# EAGLE schematic blimpy-2.0 (EAGLE 9.6.1)
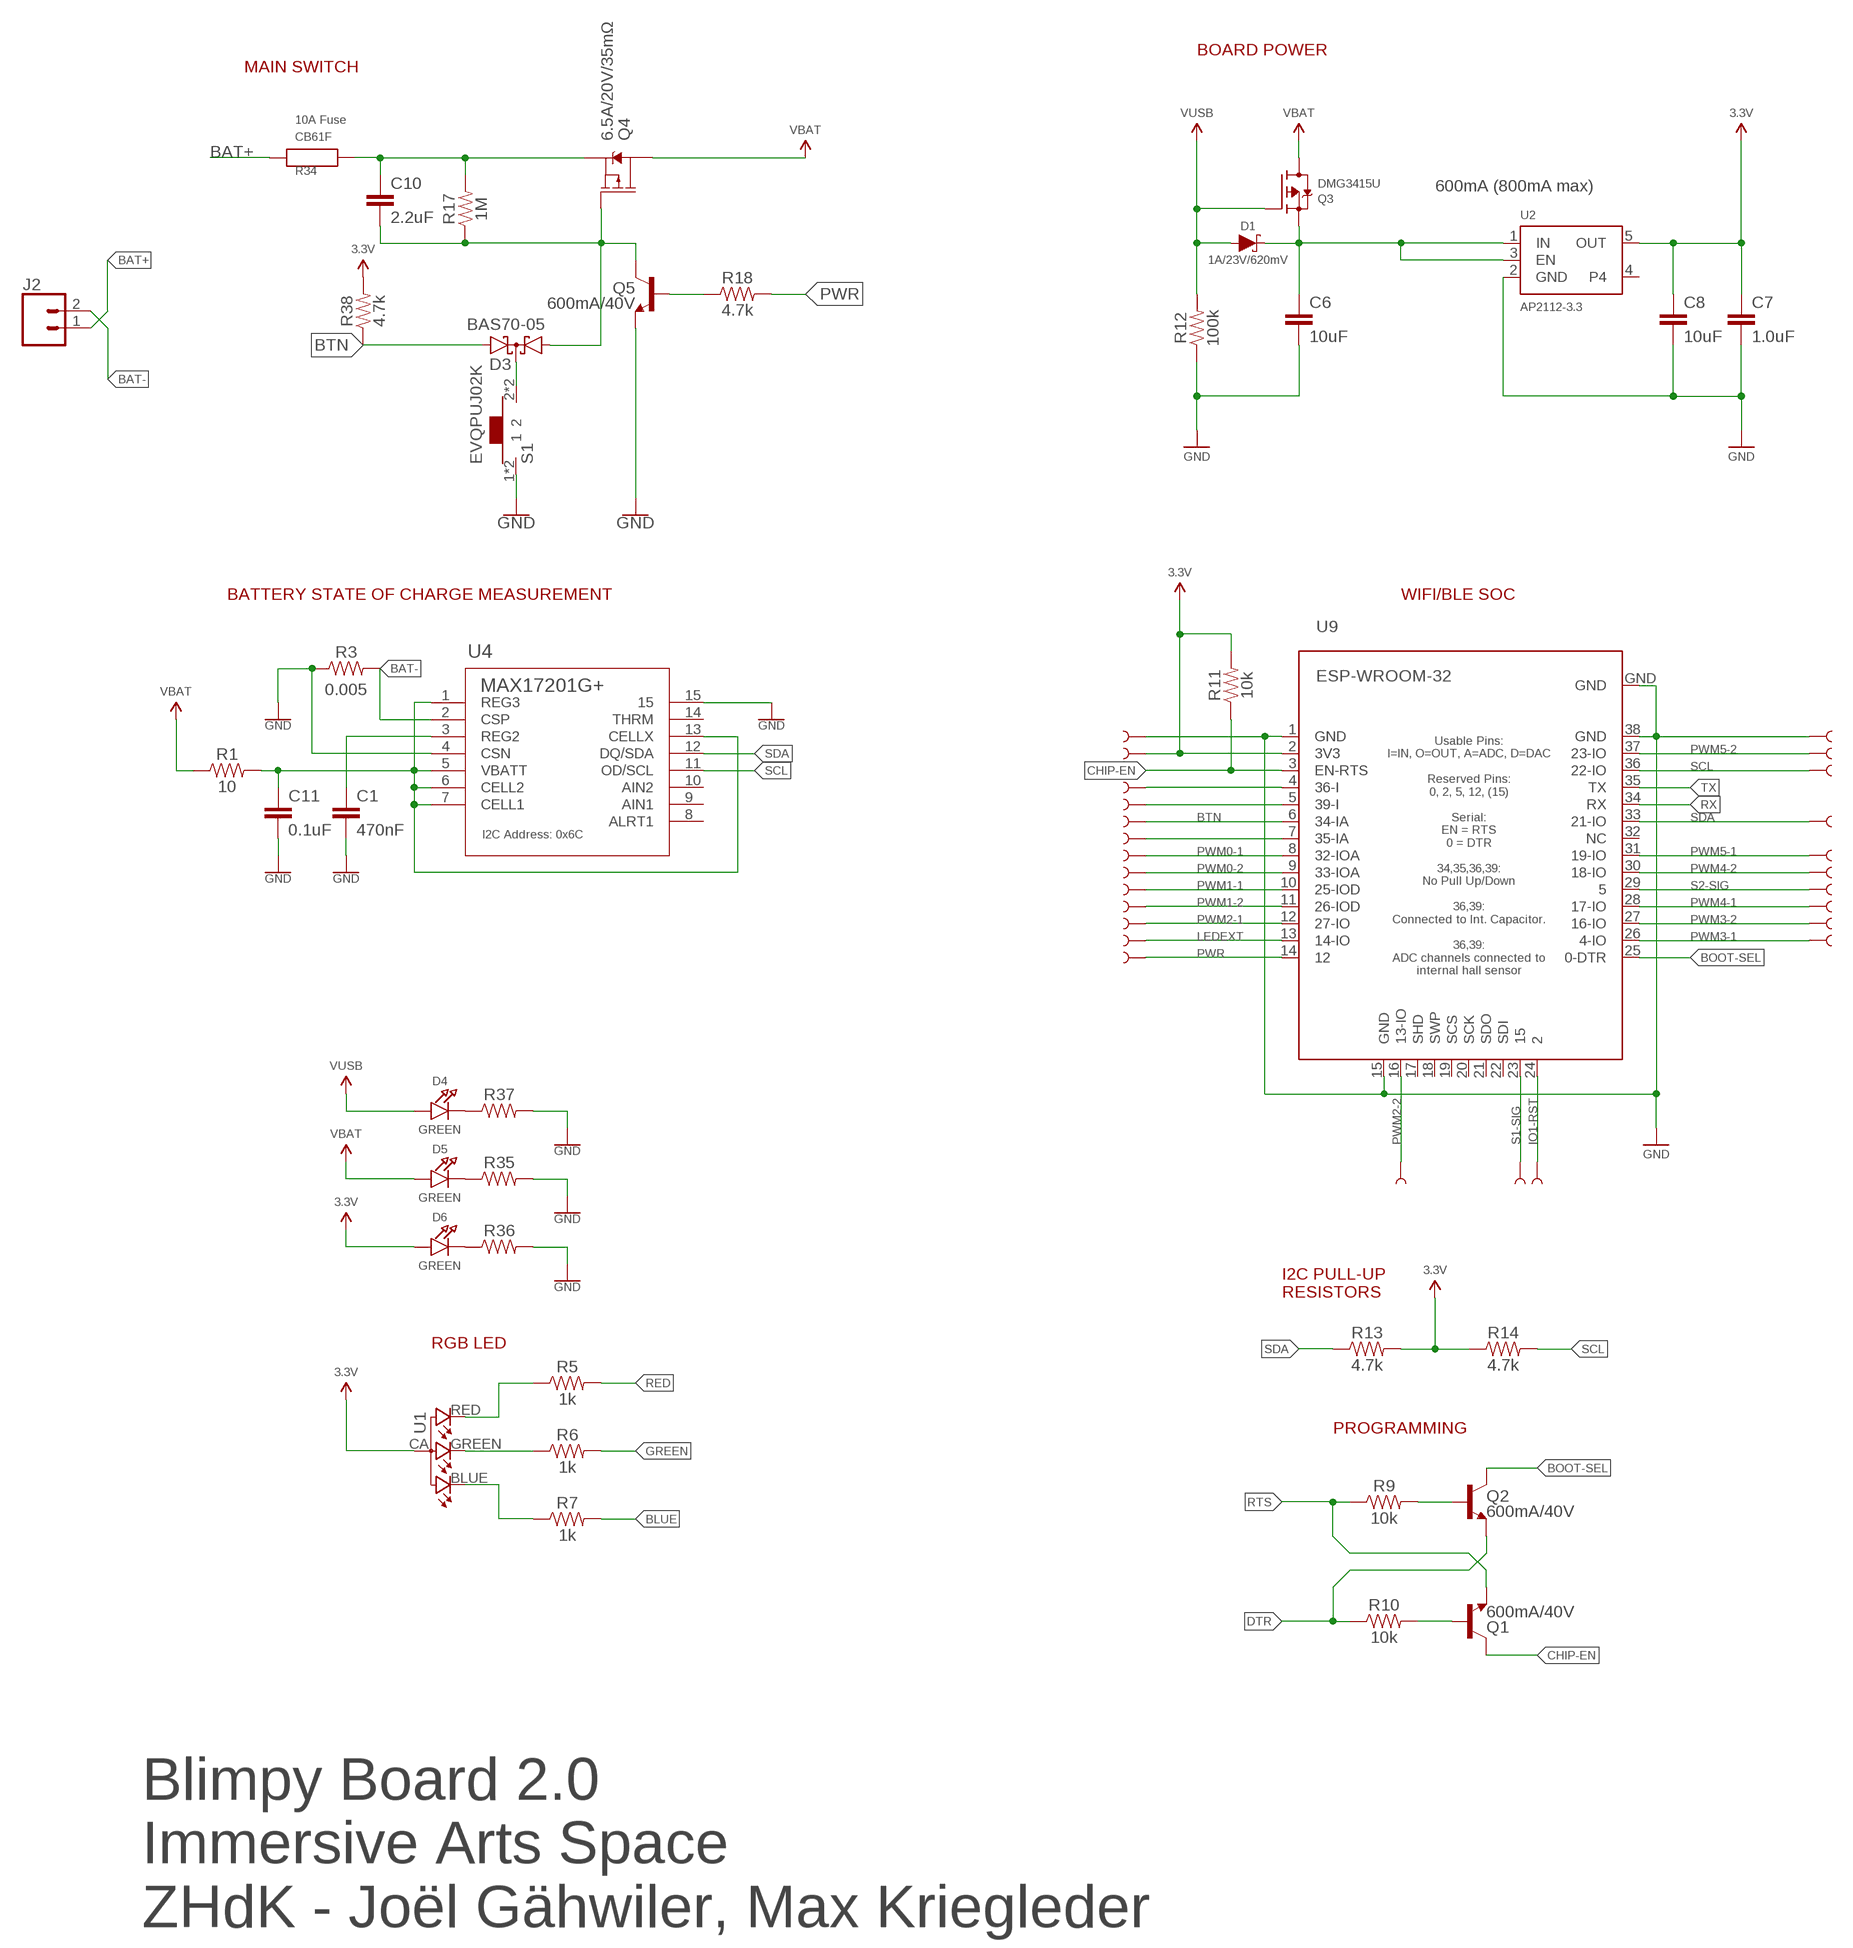
[diagram p0: schematic, sheet 1, part 1 of 2]
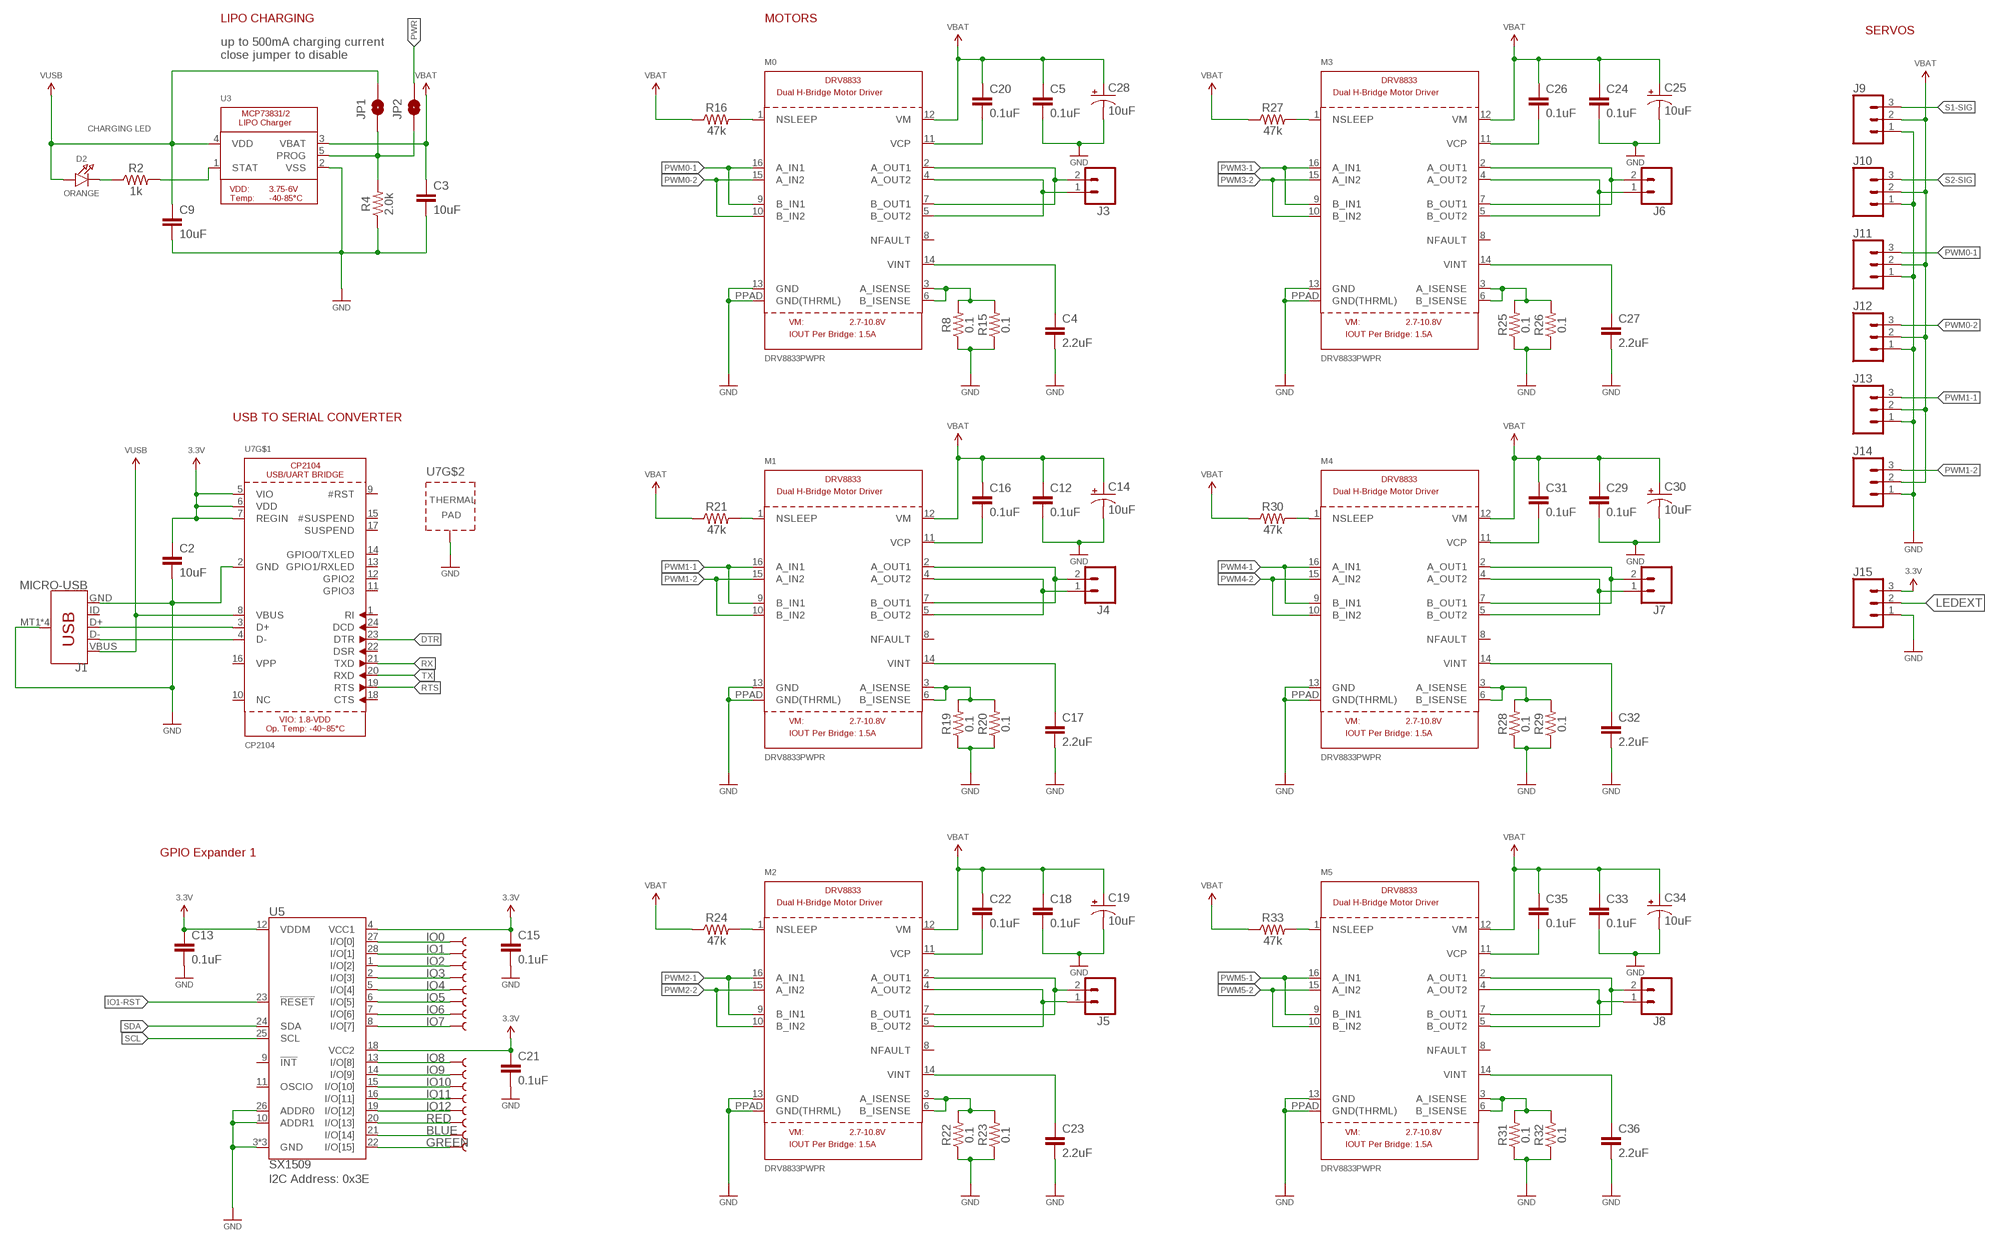
[diagram p1: schematic, sheet 1, part 2 of 2]

## Parts
C1  470nF  470NF-0608  [0603]
C2  10uF  10UF-0603-6.3V-20%  [0603]
C3  10uF  10UF-0603-6.3V-20%  [0603]
C4  2.2uF  2.2UF-0603-10V-20%  [0603]
C5  0.1uF  0.1UF-0603-25V-5%  [0603]
C6  10uF  10UF-0603-6.3V-20%  [0603]
C7  1.0uF  1.0UF-0603-16V-10%  [0603]
C8  10uF  10UF-0603-6.3V-20%  [0603]
C9  10uF  10UF-0603-6.3V-20%  [0603]
C10  2.2uF  2.2UF-0603-10V-20%  [0603]
C11  0.1uF  0.1UF-0603-25V-5%  [0603]
C12  0.1uF  0.1UF-0603-25V-5%  [0603]
C13  0.1uF  0.1UF-0603-25V-5%  [0603]
C14  10uF  10UF-POLAR-EIA3216-16V-10%(TANT)  [EIA3216]
C15  0.1uF  0.1UF-0603-25V-5%  [0603]
C16  0.1uF  0.1UF-0603-25V-5%  [0603]
C17  2.2uF  2.2UF-0603-10V-20%  [0603]
C18  0.1uF  0.1UF-0603-25V-5%  [0603]
C19  10uF  10UF-POLAR-EIA3216-16V-10%(TANT)  [EIA3216]
C20  0.1uF  0.1UF-0603-25V-5%  [0603]
C21  0.1uF  0.1UF-0603-25V-5%  [0603]
C22  0.1uF  0.1UF-0603-25V-5%  [0603]
C23  2.2uF  2.2UF-0603-10V-20%  [0603]
C24  0.1uF  0.1UF-0603-25V-5%  [0603]
C25  10uF  10UF-POLAR-EIA3216-16V-10%(TANT)  [EIA3216]
C26  0.1uF  0.1UF-0603-25V-5%  [0603]
C27  2.2uF  2.2UF-0603-10V-20%  [0603]
C28  10uF  10UF-POLAR-EIA3216-16V-10%(TANT)  [EIA3216]
C29  0.1uF  0.1UF-0603-25V-5%  [0603]
C30  10uF  10UF-POLAR-EIA3216-16V-10%(TANT)  [EIA3216]
C31  0.1uF  0.1UF-0603-25V-5%  [0603]
C32  2.2uF  2.2UF-0603-10V-20%  [0603]
C33  0.1uF  0.1UF-0603-25V-5%  [0603]
C34  10uF  10UF-POLAR-EIA3216-16V-10%(TANT)  [EIA3216]
C35  0.1uF  0.1UF-0603-25V-5%  [0603]
C36  2.2uF  2.2UF-0603-10V-20%  [0603]
D1  1A/23V/620mV  DIODE-SCHOTTKY-BAT20J  [SOD-323]
D2  ORANGE  LED0805_NOOUTLINE  [CHIPLED_0805_NOOUTLINE]
D3  BAS70-05  [SOT23]
D4  GREEN  LED0805_NOOUTLINE  [CHIPLED_0805_NOOUTLINE]
D5  GREEN  LED0805_NOOUTLINE  [CHIPLED_0805_NOOUTLINE]
D6  GREEN  LED0805_NOOUTLINE  [CHIPLED_0805_NOOUTLINE]
J1  MICRO-USB  USB_MICRO-B_SMT  [USB-MICROB]
J2  CONN_02PTH4  [1X02_XTRA_BIG]
J3  CONN_02-JST-2MM-SMT  [JST-2-SMD]
J4  CONN_02-JST-2MM-SMT  [JST-2-SMD]
J5  CONN_02-JST-2MM-SMT  [JST-2-SMD]
J6  CONN_02-JST-2MM-SMT  [JST-2-SMD]
J7  CONN_02-JST-2MM-SMT  [JST-2-SMD]
J8  CONN_02-JST-2MM-SMT  [JST-2-SMD]
J9  3-PIN SMD  CONN_03JST-SMD  [JST-3-SMD]
J10  3-PIN SMD  CONN_03JST-SMD  [JST-3-SMD]
J11  3-PIN SMD  CONN_03JST-SMD  [JST-3-SMD]
J12  3-PIN SMD  CONN_03JST-SMD  [JST-3-SMD]
J13  3-PIN SMD  CONN_03JST-SMD  [JST-3-SMD]
J14  3-PIN SMD  CONN_03JST-SMD  [JST-3-SMD]
J15  3-PIN SMD  CONN_03JST-SMD  [JST-3-SMD]
JP1  JUMPER-SMT_2_NO_SILK  [SMT-JUMPER_2_NO_SILK]
JP2  JUMPER-SMT_2_NO_SILK  [SMT-JUMPER_2_NO_SILK]
M0  DRV8833PWPR  DRV8833  [HTSSOP16]
M1  DRV8833PWPR  DRV8833  [HTSSOP16]
M2  DRV8833PWPR  DRV8833  [HTSSOP16]
M3  DRV8833PWPR  DRV8833  [HTSSOP16]
M4  DRV8833PWPR  DRV8833  [HTSSOP16]
M5  DRV8833PWPR  DRV8833  [HTSSOP16]
Q1  600mA/40V  TRANS_NPN-MMBT2222AL  [SOT23-3]
Q2  600mA/40V  TRANS_NPN-MMBT2222AL  [SOT23-3]
Q3  DMG3415U  MOSFET-P  [SOT23-R]
Q4  6.5A/20V/35mΩ  MOSFET_PCH-NDS8434  [SO08]
Q5  600mA/40V  TRANS_NPN-MMBT2222AL  [SOT23-3]
R1  10  10OHM-0603-1/10W-1%  [0603]
R2  1k  1KOHM-0603-1/10W-1%  [0603]
R3  0.005  RESISTOR1206  [1206]
R4  2.0k  2.0KOHM-0603-1/10W-5%  [0603]
R5  1k  1KOHM-0603-1/10W-1%  [0603]
R6  1k  1KOHM-0603-1/10W-1%  [0603]
R7  1k  1KOHM-0603-1/10W-1%  [0603]
R8  0.1  RESISTOR1206  [1206]
R9  10k  10KOHM-0603-1/10W-1%  [0603]
R10  10k  10KOHM-0603-1/10W-1%  [0603]
R11  10k  10KOHM-0603-1/10W-1%  [0603]
R12  100k  100KOHM-0603-1/10W-1%  [0603]
R13  4.7k  4.7KOHM-0603-1/10W-1%  [0603]
R14  4.7k  4.7KOHM-0603-1/10W-1%  [0603]
R15  0.1  RESISTOR1206  [1206]
R16  47k  47KOHM-0603-1/10W-1%  [0603]
R17  1M  1MOHM-0603-1/4W-5%  [0603]
R18  4.7k  4.7KOHM-0603-1/10W-1%  [0603]
R19  0.1  RESISTOR1206  [1206]
R20  0.1  RESISTOR1206  [1206]
R21  47k  47KOHM-0603-1/10W-1%  [0603]
R22  0.1  RESISTOR1206  [1206]
R23  0.1  RESISTOR1206  [1206]
R24  47k  47KOHM-0603-1/10W-1%  [0603]
R25  0.1  RESISTOR1206  [1206]
R26  0.1  RESISTOR1206  [1206]
R27  47k  47KOHM-0603-1/10W-1%  [0603]
R28  0.1  RESISTOR1206  [1206]
R29  0.1  RESISTOR1206  [1206]
R30  47k  47KOHM-0603-1/10W-1%  [0603]
R31  0.1  RESISTOR1206  [1206]
R32  0.1  RESISTOR1206  [1206]
R33  47k  47KOHM-0603-1/10W-1%  [0603]
R34  CB61F  [CB61F]
R35  RESISTOR0603  [0603]
R36  RESISTOR0603  [0603]
R37  RESISTOR0603  [0603]
R38  4.7k  1MOHM-0603-1/4W-5%  [0603]
S1  EVQPUJ02K  [EVQPUJ02K]
TP1  TEST-POINT3  [PAD.03X.03]
TP2  TEST-POINT3  [PAD.03X.03]
TP3  TEST-POINT3  [PAD.03X.03]
TP4  TEST-POINT3  [PAD.03X.03]
TP5  TEST-POINT3  [PAD.03X.03]
TP6  TEST-POINT3  [PAD.03X.03]
TP7  TEST-POINT3  [PAD.03X.03]
TP8  TEST-POINT3  [PAD.03X.03]
TP9  TEST-POINT3  [PAD.03X.03]
TP10  TEST-POINT3  [PAD.03X.03]
TP11  TEST-POINT3  [PAD.03X.03]
TP12  TEST-POINT3  [PAD.03X.03]
TP13  TEST-POINT3  [PAD.03X.03]
TP14  TEST-POINT3  [PAD.03X.03]
TP15  TEST-POINT3  [PAD.03X.03]
TP16  TEST-POINT3  [PAD.03X.03]
TP17  TEST-POINT3  [PAD.03X.03]
TP18  TEST-POINT3  [PAD.03X.03]
TP19  TEST-POINT3  [PAD.03X.03]
TP20  TEST-POINT3  [PAD.03X.03]
TP21  TEST-POINT3  [PAD.03X.03]
TP22  TEST-POINT3  [PAD.03X.03]
TP23  TEST-POINT3  [PAD.03X.03]
TP24  TEST-POINT3  [PAD.03X.03]
TP25  TEST-POINT3  [PAD.03X.03]
TP26  TEST-POINT3  [PAD.03X.03]
TP27  TEST-POINT3  [PAD.03X.03]
TP28  TEST-POINT3  [PAD.03X.03]
TP29  TEST-POINT3  [PAD.03X.03]
TP30  TEST-POINT3  [PAD.03X.03]
TP31  TEST-POINT3  [PAD.03X.03]
TP32  TEST-POINT3  [PAD.03X.03]
TP33  TEST-POINT3  [PAD.03X.03]
TP34  TEST-POINT3  [PAD.03X.03]
TP35  TEST-POINT3  [PAD.03X.03]
TP36  TEST-POINT3  [PAD.03X.03]
TP37  TEST-POINT3  [PAD.03X.03]
TP38  TEST-POINT3  [PAD.03X.03]
TP39  TEST-POINT3  [PAD.03X.03]
TP40  TEST-POINT3  [PAD.03X.03]
TP41  TEST-POINT3  [PAD.03X.03]
TP42  TEST-POINT3  [PAD.03X.03]
U1  PARTICLE_RGB-LED-CLMVB-FKARGB  [PARTICLE_PLCC4-2MM-RGB]
U2  AP2112-3.3  VREG_SOT23-5  [SOT23-5]
U3  MICROBUILDER_MCP73831/2  [MICROBUILDER_SOT23-5]
U4  MAX17201G+  [21-0137I_T1433-1_MXM]
U5  SX1509  [QFN-28]
U7  CP2104  [QFN24_4MM_SMSC]
U9  ESP-WROOM-32  [ESP-WROOM-32]

## Nets
3.3V: C2.1 C7.1 C8.1 C13.1 C15.1 C21.1 D6.A J15.3 R11.2 R13.2 R14.1 R38.2 TP11.P$1 U1.CA U2.5(OUT) U5.4(VCC1) U5.12(VDDM) U5.18(VCC2) U7.5(VIO) U7.6(VDD) U7.7(REGIN) U9.2(3V3)
BAT+: J2.1 R34.1
BAT-: J2.2 R3.2 U4.2(CSP)
BLUE: R7.2 TP41.P$1 U5.21(I/O[14])
BOOT-SEL: Q2.3(C) U9.25(0-DTR)
BTN: D3.2(A2) R38.1 TP8.P$1 U9.6(34-IA)
CHIP-EN: Q1.3(C) R11.1 U9.3(EN-RTS)
DTR: Q2.2(E) R10.1 U7.23(DTR)
GND: C1.2 C2.2 C3.2 C4.2 C5.2 C6.2 C7.2 C8.2 C9.2 C11.2 C12.2 C13.2 C14.- C15.2 C17.2 C18.2 C19.- C21.2 C23.2 C24.2 C25.- C27.2 C28.- C29.2 C30.- C32.2 C33.2 C34.- C36.2 J1.GND J1.MT1(SHIELD) J1.MT2(SHIELD) J1.P$1(SHIELD) J1.P$2(SHIELD) J9.1 J10.1 J11.1 J12.1 J13.1 J14.1 J15.1 M0.13(GND) M0.PPAD(GND(THRML)) M1.13(GND) M1.PPAD(GND(THRML)) M2.13(GND) M2.PPAD(GND(THRML)) M3.13(GND) M3.PPAD(GND(THRML)) M4.13(GND) M4.PPAD(GND(THRML)) M5.13(GND) M5.PPAD(GND(THRML)) Q5.2(E) R3.1 R4.1 R8.1 R12.1 R15.1 R19.1 R20.1 R22.1 R23.1 R25.1 R26.1 R28.1 R29.1 R31.1 R32.1 R35.2 R36.2 R37.2 S1.1 S1.3 TP12.P$1 TP13.P$1 U2.2(GND) U3.2(VSS) U4.4(CSN) U4.15 U5.3(GND) U5.10(ADDR1) U5.17(GND) U5.26(ADDR0) U5.29(GND) U7.2(GND) U7.THERM(TP) U9.1(GND) U9.15(GND) U9.38(GND) U9.GND
GREEN: R6.2 TP42.P$1 U5.22(I/O[15])
IO0: TP27.P$1 U5.27(I/O[0])
IO1: TP28.P$1 U5.28(I/O[1])
IO1-RST: TP26.P$1 U5.23(!RESET) U9.24
IO2: TP29.P$1 U5.1(I/O[2])
IO3: TP30.P$1 U5.2(I/O[3])
IO4: TP31.P$1 U5.5(I/O[4])
IO5: TP32.P$1 U5.6(I/O[5])
IO6: TP33.P$1 U5.7(I/O[6])
IO7: TP34.P$1 U5.8(I/O[7])
IO8: TP35.P$1 U5.13(I/O[8])
IO9: TP36.P$1 U5.14(I/O[9])
IO10: TP37.P$1 U5.15(I/O[10])
IO11: TP38.P$1 U5.16(I/O[11])
IO12: TP39.P$1 U5.19(I/O[12])
LEDEXT: J15.2 TP5.P$1 U9.13(14-IO)
N$1: D2.C R2.1
N$2: J1.D+ U7.3(D+)
N$3: R2.2 U3.1(STAT)
N$4: JP1.1 JP2.1 R4.2 U3.5(PROG)
N$5: M0.1(NSLEEP) R16.2
N$6: J1.D- U7.4(D-)
N$7: C6.1 D1.C Q3.2(S) U2.1(IN) U2.3(EN)
N$8: C1.1 U4.3(REG2)
N$9: R5.1 U1.RED
N$10: R7.1 U1.BLUE
N$11: R6.1 U1.GREEN
N$12: Q1.1(B) R10.2
N$13: Q2.1(B) R9.2
N$14: M0.3(A_ISENSE) M0.6(B_ISENSE) R8.2 R15.2
N$15: C11.1 R1.2 U4.1(REG3) U4.5(VBATT) U4.6(CELL2) U4.7(CELL1) U4.13(CELLX)
N$16: C10.2 D3.1(A1) Q4.4(G) Q5.3(C) R17.1
N$17: D4.C R37.1
N$18: C10.1 Q4.1(S) Q4.2(S) Q4.3(S) R17.2 R34.2
N$19: TP9.P$1 U9.5(39-I)
N$21: TP7.P$1 U9.7(35-IA)
N$22: D3.3(C) S1.2 S1.4
N$23: Q5.1(B) R18.1
N$24: J4.1 M1.4(A_OUT2) M1.5(B_OUT2)
N$25: J4.2 M1.2(A_OUT1) M1.7(B_OUT1)
N$26: C17.1 M1.14(VINT)
N$27: C16.2 M1.11(VCP)
N$28: M1.3(A_ISENSE) M1.6(B_ISENSE) R19.2 R20.2
N$29: M1.1(NSLEEP) R21.2
N$30: J6.1 M3.4(A_OUT2) M3.5(B_OUT2)
N$31: J5.1 M2.4(A_OUT2) M2.5(B_OUT2)
N$32: C23.1 M2.14(VINT)
N$33: C22.2 M2.11(VCP)
N$34: M2.3(A_ISENSE) M2.6(B_ISENSE) R22.2 R23.2
N$35: M2.1(NSLEEP) R24.2
N$36: J6.2 M3.2(A_OUT1) M3.7(B_OUT1)
N$37: J3.2 M0.2(A_OUT1) M0.7(B_OUT1)
N$38: J7.1 M4.4(A_OUT2) M4.5(B_OUT2)
N$39: C27.1 M3.14(VINT)
N$40: C26.2 M3.11(VCP)
N$41: M3.3(A_ISENSE) M3.6(B_ISENSE) R25.2 R26.2
N$42: M3.1(NSLEEP) R27.2
N$43: J8.2 M5.2(A_OUT1) M5.7(B_OUT1)
N$44: J7.2 M4.2(A_OUT1) M4.7(B_OUT1)
N$45: C32.1 M4.14(VINT)
N$46: C31.2 M4.11(VCP)
N$47: M4.3(A_ISENSE) M4.6(B_ISENSE) R28.2 R29.2
N$48: J5.2 M2.2(A_OUT1) M2.7(B_OUT1)
N$49: M4.1(NSLEEP) R30.2
N$50: J8.1 M5.4(A_OUT2) M5.5(B_OUT2)
N$51: D6.C R36.1
N$52: C36.1 M5.14(VINT)
N$53: C35.2 M5.11(VCP)
N$54: M5.3(A_ISENSE) M5.6(B_ISENSE) R31.2 R32.2
N$55: M5.1(NSLEEP) R33.2
N$56: D5.C R35.1
N$57: TP10.P$1 U9.4(36-I)
N$58: J3.1 M0.4(A_OUT2) M0.5(B_OUT2)
N$61: C4.1 M0.14(VINT)
N$64: C20.2 M0.11(VCP)
PWM0-1: J11.3 M0.9(B_IN1) M0.16(A_IN1) TP1.P$1 U9.8(32-IOA)
PWM0-2: J12.3 M0.10(B_IN2) M0.15(A_IN2) TP2.P$1 U9.9(33-IOA)
PWM1-1: J13.3 M1.9(B_IN1) M1.16(A_IN1) TP3.P$1 U9.10(25-IOD)
PWM1-2: J14.3 M1.10(B_IN2) M1.15(A_IN2) TP6.P$1 U9.11(26-IOD)
PWM2-1: M2.9(B_IN1) M2.16(A_IN1) TP17.P$1 U9.12(27-IO)
PWM2-2: M2.10(B_IN2) M2.15(A_IN2) TP23.P$1 U9.16(13-IO)
PWM3-1: M3.9(B_IN1) M3.16(A_IN1) TP16.P$1 U9.26(4-IO)
PWM3-2: M3.10(B_IN2) M3.15(A_IN2) TP15.P$1 U9.27(16-IO)
PWM4-1: M4.9(B_IN1) M4.16(A_IN1) TP22.P$1 U9.28(17-IO)
PWM4-2: M4.10(B_IN2) M4.15(A_IN2) TP21.P$1 U9.30(18-IO)
PWM5-1: M5.9(B_IN1) M5.16(A_IN1) TP20.P$1 U9.31(19-IO)
PWM5-2: M5.10(B_IN2) M5.15(A_IN2) TP14.P$1 U9.37(23-IO)
PWR: JP2.2 R18.2 TP4.P$1 U9.14
RED: R5.2 TP40.P$1 U5.20(I/O[13])
RTS: Q1.2(E) R9.1 U7.19(RTS)
RX: U7.21(TXD) U9.34(RX)
S1-SIG: J9.3 TP24.P$1 U9.23
S2-SIG: J10.3 TP25.P$1 U9.29
SCL: R14.2 TP18.P$1 U4.11(OD/SCL) U5.25(SCL) U9.36(22-IO)
SDA: R13.1 TP19.P$1 U4.12(DQ/SDA) U5.24(SDA) U9.33(21-IO)
TX: U7.20(RXD) U9.35(TX)
V_BATT: C3.1 C5.1 C12.1 C14.+ C16.1 C18.1 C19.+ C20.1 C22.1 C24.1 C25.+ C26.1 C28.+ C29.1 C30.+ C31.1 C33.1 C34.+ C35.1 D5.A J9.2 J10.2 J11.2 J12.2 J13.2 J14.2 M0.12(VM) M1.12(VM) M2.12(VM) M3.12(VM) M4.12(VM) M5.12(VM) Q3.3(D) Q4.5(D) Q4.6(D) Q4.7(D) Q4.8(D) R1.1 R16.1 R21.1 R24.1 R27.1 R30.1 R33.1 U3.3(VBAT) ; supply symbol labelled VBAT
V_USB: C9.1 D1.A D2.A D4.A J1.VBUS JP1.2 Q3.1(G) R12.2 U3.4(VDD) U7.8(VBUS) ; supply symbol labelled VUSB
Unconnected: J1.ID M0.8(NFAULT) M1.8(NFAULT) M2.8(NFAULT) M3.8(NFAULT) M4.8(NFAULT) M5.8(NFAULT) U2.4 U4.8(ALRT1) U4.9(AIN1) U4.10(AIN2) U4.14(THRM) U5.9(!INT) U5.11(OSCIO) U7.1(RI) U7.9(#RST) U7.10(NC) U7.11(GPIO3) U7.12(GPIO2) U7.13(GPIO1/RXLED) U7.14(GPIO0/TXLED) U7.15(#SUSPEND) U7.16(VPP) U7.17(SUSPEND) U7.18(CTS) U7.22(DSR) U7.24(DCD) U9.17(SHD) U9.18(SWP) U9.19(SCS) U9.20(SCK) U9.21(SDO) U9.22(SDI) U9.32(NC)

## Notes on the sheet
- LIPO CHARGING | MOTORS
- BOARD POWER | SERVOS
- MAIN SWITCH
- up to 500mA charging current
  close jumper to disable
- 10A Fuse
- 600mA (800mA max) | CHARGING LED
- BATTERY STATE OF CHARGE MEASUREMENT | WIFI/BLE SOC | USB TO SERIAL CONVERTER
- I2C Address: 0x6C
- GPIO Expander 1
- I2C PULL-UP
  RESISTORS
- RGB LED
- PROGRAMMING
- I2C Address: 0x3E
- Blimpy Board 2.0
  Immersive Arts Space
  ZHdK - Joël Gähwiler, Max Kriegleder

## Library data of the parts
C1 = SparkFun-Capacitors:470NF: 0.47uF/470nF ceramic capacitors A capacitor is a passive two-terminal electrical component used to store electrical energy temporarily in an electric field.
C2 C3 C6 C8 C9 = SparkFun-Capacitors:10UF: 10.0µF ceramic capacitors A capacitor is a passive two-terminal electrical component used to store electrical energy temporarily in an electric field.; PROD_ID: CAP-11015
C4 C10 C17 C23 C27 C32 C36 = SparkFun-Capacitors:2.2UF: 2.2µF ceramic capacitors A capacitor is a passive two-terminal electrical component used to store electrical energy temporarily in an electric field.; PROD_ID: CAP-07888
C5 C11-C13 C15 C16 C18 C20-C22 C24 C26 C29 C31 C33 C35 = SparkFun-Capacitors:0.1UF: 0.1µF ceramic capacitors A capacitor is a passive two-terminal electrical component used to store electrical energy temporarily in an electric field.; PROD_ID: CAP-08604
C7 = SparkFun-Capacitors:1.0UF: 1µF ceramic capacitors A capacitor is a passive two-terminal electrical component used to store electrical energy temporarily in an electric field.; PROD_ID: CAP-00868
C14 C19 C25 C28 C30 C34 = SparkFun-Capacitors:10UF-POLAR: 10.0µF polarized capacitors A capacitor is a passive two-terminal electrical component used to store electrical energy temporarily in an electric field.; PROD_ID: CAP-00811
D1 = SparkFun-DiscreteSemi:DIODE-SCHOTTKY: Schottky diode A Schottky diode is a semiconductor diode which has a low forward voltage drop and a very fast switching action.; PROD_ID: DIO-11623
D2 D4-D6 = microbuilder:LED: LED 0603 - 0603 Surface Mount Package 2mA: Green LED - Low Power (3.9mcd, 2ma, 1.7Vf) - Digikey: 475-2709-2-ND Orange LED - Low Power (9.8mcd, 2ma, 1.8Vf) - Digikey: 475-1194-2-ND Red LED - Low Power (5mcd, 2ma, 1.8Vf) - Digikey: 475-1195-2-ND Yellow LED - Low Power (7mcd, 2ma, 1.8Vf) - Digikey: 475-1196-2-ND 5mA: Blue LED - Low Power (17mcd, 5ma, 2.9Vf) - Digikey: LNJ937W8CRACT-ND 0805 - 0805 Surface Mount Package 2mA: Red LED (8.8mcd, 2mA, 1.8Vf, Clear) - Low Power [Digikey: 475-2510-1-ND] Green LED (5mcd, 2mA, 1.8Vf, Clear) - Low Power [Digikey: 475-2730-1-ND] Yellow LED (11.3mcd, 2mA, 1.8Vf, Clear) - Low Power [Digikey: 475-2555-1-ND] 20mA: Red LED (104mcd, 20mA, Diffused) - LS R976 [Digikey: 475-1278-6-ND] Red LED (12mcd, 20mA, 2.0Vf, Clear) - APT2012EC [Digikey: 754-1128-1-ND] Green LED (15mcd, 20mA, 2.2Vf, Clear) - APT2012GC [Digikey: 754-1131-1-ND] Orange LED (160mcd, 20mA, 2.1Vf, Clear) - APT2012SECK [Digikey: 754-1130-1-ND] 1206 - 1206 Surface Mount Package Green LED (26mcd, 20mA, Diffused) - LG N971 [Digikey: 475-1407-6-ND] Red LED (15mcd, 20mA, Diffused) - LH N974 [Digikey: 475-1416-6-ND] Cree - Cree High-Power Surface Mount LEDs XPEBWT-L1-0000-00D50 - White 111lm 350mA 2.9Vf 6200K 110° XTEAWT-00-0000-00000LEE3 - White 114lm 350mA 2.85Vf 5000K 115° Everlight - Everlight 45-21 Series Surface Mount LEDs 45-21/QK2C-B2832AC2CB2/2T - Warm White 2000mcd 20mA 3.25Vf 3050K 120° 45-21/LK2C-B38452C4CB2/2T - Nuetral White 2000mcd 20mA 3.25Vf 4150K 120° 45-21/LK2C-B50634C6CB2/2T - Cold White 2200mcd 20mA 3.25Vf 5650K 120° PLCC2 Reverse Mount LS T77K-J1L2-1-0-2-R18-Z - Red 11.25mcd 2mA 1.8Vf 630nm 120° LO T77K-L1M2-24-Z - Orange 19.6mcd 2mA 1.8Vf 606nm 120° LY T77K-K2M1-26-Z - Yellow 15.7mcd 2mA 1.8Vf 587nm 120°
D3 = diode:BAS70-05: Silicon Schottky Diodes General-purpose diode for high-speed switching
J1 = SparkFun-Connectors:USB_MICRO-B: USB Type Micro-B Connector Male/female and PTH/SMT variants SparkFun Products: SparkFun microB USB Breakout <https://www.sparkfun.com/products/12035> SparkFun USB microB Plug Breakout <https://www.sparkfun.com/products/10031> SparkFun ESP8266 Thing <https://www.sparkfun.com/products/13231>; PROD_ID: CONN-09505; SF_ID: PRT-08533
J2 = SparkFun-Connectors:CONN_02: Multi connection point. Often used as Generic Header-pin footprint for 0.1 inch spaced/style header connections On any of the 0.1 inch spaced packages, you can populate with these: Break Away Headers - Straight <https://www.sparkfun.com/products/116> (PRT-00116) Break Away Male Headers - Right Angle <https://www.sparkfun.com/products/553> (PRT-00553) Female Headers <https://www.sparkfun.com/products/115> (PRT-00115) Break Away Headers - Machine Pin <https://www.sparkfun.com/products/117> (PRT-00117) Break Away Female Headers - Swiss Machine Pin <https://www.sparkfun.com/products/743> (PRT-00743) For SCREWTERMINALS and SPRING TERMINALS visit here: Screw Terimnals on SparkFun.com <https://www.sparkfun.com/search/results?term=Screw+Terminals> (5mm/3.5mm/2.54mm spacing) This device is also useful as a general connection point to wire up your design to another part of your project. Our various solder wires solder well into these plated through hole pads. Hook-Up Wire - Assortment (Stranded, 22 AWG) <https://www.sparkfun.com/products/11375> (PRT-11375) Hook-Up Wire - Assortment (Solid Core, 22 AWG) <https://www.sparkfun.com/products/11367> (PRT-11367) View the entire wire category on our website here <https://www.sparkfun.com/categories/141> Special notes: Molex polarized connector foot print use with: PRT-08233 with associated crimp pins and housings. 2.54_SCREWTERM for use with PRT-10571. 3.5mm Screw Terminal footprints for PRT-08084 5mm Screw Terminal footprints for use with PRT-08432
J3-J8 = SparkFun-Connectors:CONN_02: Multi connection point. Often used as Generic Header-pin footprint for 0.1 inch spaced/style header connections On any of the 0.1 inch spaced packages, you can populate with these: Break Away Headers - Straight <https://www.sparkfun.com/products/116> (PRT-00116) Break Away Male Headers - Right Angle <https://www.sparkfun.com/products/553> (PRT-00553) Female Headers <https://www.sparkfun.com/products/115> (PRT-00115) Break Away Headers - Machine Pin <https://www.sparkfun.com/products/117> (PRT-00117) Break Away Female Headers - Swiss Machine Pin <https://www.sparkfun.com/products/743> (PRT-00743) For SCREWTERMINALS and SPRING TERMINALS visit here: Screw Terimnals on SparkFun.com <https://www.sparkfun.com/search/results?term=Screw+Terminals> (5mm/3.5mm/2.54mm spacing) This device is also useful as a general connection point to wire up your design to another part of your project. Our various solder wires solder well into these plated through hole pads. Hook-Up Wire - Assortment (Stranded, 22 AWG) <https://www.sparkfun.com/products/11375> (PRT-11375) Hook-Up Wire - Assortment (Solid Core, 22 AWG) <https://www.sparkfun.com/products/11367> (PRT-11367) View the entire wire category on our website here <https://www.sparkfun.com/categories/141> Special notes: Molex polarized connector foot print use with: PRT-08233 with associated crimp pins and housings. 2.54_SCREWTERM for use with PRT-10571. 3.5mm Screw Terminal footprints for PRT-08084 5mm Screw Terminal footprints for use with PRT-08432; PROD_ID: CONN-11443
J9-J15 = SparkFun-Connectors:CONN_03: Multi connection point. Often used as Generic Header-pin footprint for 0.1 inch spaced/style header connections On any of the 0.1 inch spaced packages, you can populate with these: Break Away Headers - Straight <https://www.sparkfun.com/products/116> (PRT-00116) Break Away Male Headers - Right Angle <https://www.sparkfun.com/products/553> (PRT-00553) Female Headers <https://www.sparkfun.com/products/115> (PRT-00115) Break Away Headers - Machine Pin <https://www.sparkfun.com/products/117> (PRT-00117) Break Away Female Headers - Swiss Machine Pin <https://www.sparkfun.com/products/743> (PRT-00743) Stackable Header - 3 Pin (Female, 0.1") <https://www.sparkfun.com/products/13875> (PRT-13875) For SCREWTERMINALS and SPRING TERMINALS visit here: Screw Terimnals on SparkFun.com <https://www.sparkfun.com/search/results?term=Screw+Terminals> (5mm/3.5mm/2.54mm spacing) This device is also useful as a general connection point to wire up your design to another part of your project. Our various solder wires solder well into these plated through hole pads. Hook-Up Wire - Assortment (Stranded, 22 AWG) <https://www.sparkfun.com/products/11375> (PRT-11375) Hook-Up Wire - Assortment (Solid Core, 22 AWG) <https://www.sparkfun.com/products/11367> (PRT-11367) View the entire wire category on our website here <https://www.sparkfun.com/categories/141> Special notes: Molex polarized connector foot print use with SKU : PRT-08232 with associated crimp pins and housings.; PROD_ID: CONN-12591
JP1 JP2 = SparkFun-Jumpers:JUMPER-SMT_2_NO: Normally open jumper This jumper has two pads in close proximity to each other. Apply solder to close the connection. Round pads are easier to solder for beginners, but are a lot larger. SparkFun Product that uses the round pads: SparkFun EL Sequencer <https://www.sparkfun.com/products/12781>
M0 M1-M5 = microbuilder:DRV8833: DRV8833 Dual H-Bridge Motor Driver -- HTSSOP Package
Q1 Q2 Q5 = SparkFun-DiscreteSemi:TRANS_NPN: NPN transistor Current controlled devices typically used to amplify current or used as a switch. BC547 - COM-08928 <http://www.sparkfun.com/products/8928> (TO-92 45V 100mA) (1.Collector 2.Base 3.Emitter) 2N3904 - COM-00521 <http://www.sparkfun.com/products/521> (TO-92 40V 200mA) (1.Emitter 2.Base 3.Collector) P2N2222A - COM-12852 <http://www.sparkfun.com/products/12852> (TO-92 40V 600mA) (1.Collector 2.Base 3.Emitter); PROD_ID: TRANS-08049
Q3 = microbuilder:MOSFET-P: P-Channel Mosfet LEGEND VDS: Voltage Drain-Source ID: Drain Current RDS(ON): Drain-Source On-State Resistance VGS(TH): Gate-Source Threshold Voltage CISS: Drain-Source Input Capacitance SOT-23 Name VDS ID RDS(ON) VGS(TH) CISS Order Number IRLML5103 30V 760mA 600 mOhm -- 75pF @ 25V Digikey: IRLML5103PBFCT-ND IRLML6401 12V 4.3A 50 mOhm 950mV @ 250µA 830pF @ 10V Digikey: IRLML6401PBFTR-ND NTR0202PL 20V 400mA 800 mOhm 2.3V @ 250uA 70pF @ 5V Digikey: NTR0202PLT1GOSTR-ND NTR4101PT1G 20V 1.8A 85 mOhm 1.2V @ 250uA 675pF @ 10V Digikey: NTR4101PT1GOSCT-ND DMP2004K 20V 600mA 900 mOhm 1V @ 250uA 175pF @ 16V Digikey: DMP2004KDICT-ND PMV65XP 20V 3.9A 76 mOhm 950mV @ 1mA 725pF @ 20V Digikey: 568-2358-2-ND TO-252 Name VDS ID RDS(ON) VGS(TH) CISS Order Number AOD417 30V 25A 34 mOhm 3V @ 250µA 920pF @ 15V Digikey: 785-1106-2-ND PowerPak Name VDS ID RDS(ON) VGS(TH) CISS Order Number AON7401 30V 12A 14 mOhm 3V @ 250µA 2600pF @ 15V Digikey: 785-1302-1-ND
Q4 = SparkFun-DiscreteSemi:MOSFET_PCH: P-channel MOSFETs Voltage controlled devices that allow control of high current outputs. SparkFun Products: SparkFun ESP32 Thing <https://www.sparkfun.com/products/13907> SparkFun ESP8266 Thing <https://www.sparkfun.com/products/13231>; PROD_ID: TRANS-08355
R1 = SparkFun-Resistors:10OHM: 10Ω resistor A resistor is a passive two-terminal electrical component that implements electrical resistance as a circuit element. Resistors act to reduce current flow, and, at the same time, act to lower voltage levels within circuits. - Wikipedia; PROD_ID: RES-12581
R2 R5-R7 = SparkFun-Resistors:1KOHM: 1kΩ resistor A resistor is a passive two-terminal electrical component that implements electrical resistance as a circuit element. Resistors act to reduce current flow, and, at the same time, act to lower voltage levels within circuits. - Wikipedia; PROD_ID: RES-07856
R3 R8 R15 R19 R20 R22 R23 R25 R26 R28 R29 R31 R32 R35-R37 = SparkFun-Resistors:RESISTOR: Generic Resistor Package
R4 = SparkFun-Resistors:2.0KOHM: 2kΩ resistor A resistor is a passive two-terminal electrical component that implements electrical resistance as a circuit element. Resistors act to reduce current flow, and, at the same time, act to lower voltage levels within circuits. - Wikipedia; PROD_ID: RES-08296
R9-R11 = SparkFun-Resistors:10KOHM: 10kΩ resistor A resistor is a passive two-terminal electrical component that implements electrical resistance as a circuit element. Resistors act to reduce current flow, and, at the same time, act to lower voltage levels within circuits. - Wikipedia; PROD_ID: RES-00824
R12 = SparkFun-Resistors:100KOHM: 100kΩ resistor A resistor is a passive two-terminal electrical component that implements electrical resistance as a circuit element. Resistors act to reduce current flow, and, at the same time, act to lower voltage levels within circuits. - Wikipedia; PROD_ID: RES-07828
R13 R14 R18 = SparkFun-Resistors:4.7KOHM: 4.7kΩ resistor A resistor is a passive two-terminal electrical component that implements electrical resistance as a circuit element. Resistors act to reduce current flow, and, at the same time, act to lower voltage levels within circuits. - Wikipedia; PROD_ID: RES-07857
R16 R21 R24 R27 R30 R33 = SparkFun-Resistors:47KOHM: 47kΩ resistor A resistor is a passive two-terminal electrical component that implements electrical resistance as a circuit element. Resistors act to reduce current flow, and, at the same time, act to lower voltage levels within circuits. - Wikipedia; PROD_ID: RES-07871
R17 = SparkFun-Resistors:1MOHM: 1MΩ resistor A resistor is a passive two-terminal electrical component that implements electrical resistance as a circuit element. Resistors act to reduce current flow, and, at the same time, act to lower voltage levels within circuits. - Wikipedia; PROD_ID: RES-07868
R34 = chlimax:CB61F
R38 = SparkFun-Resistors:1MOHM: 1MΩ resistor A resistor is a passive two-terminal electrical component that implements electrical resistance as a circuit element. Resistors act to reduce current flow, and, at the same time, act to lower voltage levels within circuits. - Wikipedia; PROD_ID: RES-07868; VALUE: 1M
S1 = chlimax:EVQPUJ02K
TP1-TP42 = SparkFun-Connectors:TEST-POINT: SparkFun Test Points Bare copper test points for troubleshooting or In-Circuit-Testing. These are used by our Production team for verifying production board runs using pogo-pins on test beds. SparkFun Products: SparkFun LSM9DS1 Breakout <https://www.sparkfun.com/products/13284> SparkFun PSOC <https://www.sparkfun.com/products/13714> SparkFun Load Cell Amplifier <https://www.sparkfun.com/products/13879>
U1 = blimpy-2.0:PARTICLE_RGB-LED-CLMVB-FKA: CREE CLMVB-FKA RGB LED 2mm x 2mm
U2 = microbuilder:VREG_SOT23-5: SOT23-5 Fixed Voltage Regulators Part Current Out V Out V In V Dropout θJA (°C/W) TJ (°C) Digikey Part No. ADP121 150mA 3.3V 3.4-5.5V 0.09V @ 150mA -- -- ADP121-AUJZ33R7CT-ND ADP121 150mA 3.0V 3.1-5.5V 0.09V @ 150mA -- -- ADP121-AUJZ30R7CT-ND ADP122 300mA 3.3V 3.4-5.5V 0.085V @ 300mA -- -- ADP122AUJZ-3.3-R7CT-ND ADP1712 300mA 3.3V 3.5-5.5V 0.17V @ 300mA -- -- ADP1712AUJZ-3.3-R7TR-ND AP7311 (Low Cost) 150mA 3.3V 3.5-6V 0.15V @ 150mA -- -- AP7311-33WG-7DICT-ND LD39015M18R 150mA 1.8V 1.9V-5.5V 0.08V @ 100mA -- -- 497-6977-1-ND LP2985A-33DBVR 150mA 3.3V 3.3-16V 0.28V @ 150mA 206 150 296-18479-1-ND MCP1824T-3302E/OT 300mA 3.3V 3.5V-6V 0.2V @ 300mA -- -- MCP1824T-3302E/OTCT-ND MIC5205-2.5YM5 TR 150mA 2.5V 2.7-16V 0.165V @ 150mA -- -- 576-1257-2-ND MIC5205-3.0YM5 TR 150mA 3.0V 3.2V-16V 0.165V @ 150mA -- -- 576-1258-2-ND MIC5205-3.3YM5 TR 150mA 3.3V 3.5V-16V 0.165V @ 150mA -- -- 576-1259-2-ND TPS780330220 150mA 3.3V+2.2V 3.6-5.5V 250mV Max -- -- 296-23332-1-ND TDA3663/N1,135 100mA 3.3V 3.5-45V 0.18V @ 50mA -- -- 568-5343-1-ND Max operating temp can be calculated using θJA, TJ (max junction temperature), and power in watts. Set the "Maximum Ambient Temperature" until it reaches TJ ("Max Junction Temperature"), which is the absolute limit for safe use of the regulator: Heat Sink Temperature Calculator <http://www.daycounter.com/Calculators/Heat-Sink-Temperature-Calculator.phtml> For example, With 12V source into a 3.3V LP2985 and a 30mA load, we are dissipating (12V-3.3V) * 0.03A = 0.261W. With a θJA of 206 °C/W, a TJ of 150°C, and 261mW we can safely use the chip without a heat sink up to 75°C (=147.1°C Junction Temperature).
U3 = blimpy-2.0:MICROBUILDER_MCP73831/2: MCP73831/2 LIPO Charger VDD: 3.75 - 6V Temp -40 - 85°C Programmable Charge Rate: 15-500mA NOTE: STAT is a tri-state logic output on the MCP73831 and an open-drain output on the MCP73832. SOT23-5 with 4.2V output and tri-state logic on STAT = MCP73831T-2ACI/OT
U4 = chlimax:MAX17201G+; BUILT_BY: UL_Team_Molly; COPYRIGHT: Copyright (C) 2018 Accelerated Designs. All rights reserved; MANUFACTURER_PART_NUMBER: MAX17201G+; SOURCELIBRARY: Maxim_2018-10-24; VENDOR: Maxim Integrated Products
U5 = SparkFun-IC-Special-Function:SX1509: Semtech SX1509 The SX1509 is a complete ultra low voltage 1.2V to 3.6V General Purpose parallel Input/Output (GPIO) expanders ideal for low power handheld battery powered equipment. This version comes in a 16-channel configuration and allows easy serial expansion of I/O through a standard 400kHz I2C interface. GPIO devices can provide additional control and monitoring when the microcontroller or chipset has insufficient I/O ports, or in systems where serial communication and control from a remote location is advantageous. Datasheet <http://cdn.sparkfun.com/datasheets/BreakoutBoards/sx1509.pdf> SparkFun Products SparkFun 16 Output I/O Expander Breakout - SX1509 <https://www.sparkfun.com/products/13601> (BOB-13601) SparkFun Line Follower Array <https://www.sparkfun.com/products/13582> (SEN-13582); PROD_ID: IC-11311
U7 = microbuilder:CP2104: CP2104 - USB to UART Bridge VDD Output: 3.45V
U9 = ESP32:ESP-WROOM-32